# Altium schematic sheet 06_LED&Config.SchDoc
size A3; Engineer: Mehmet Selcuk Yayan; Organization: Procenne
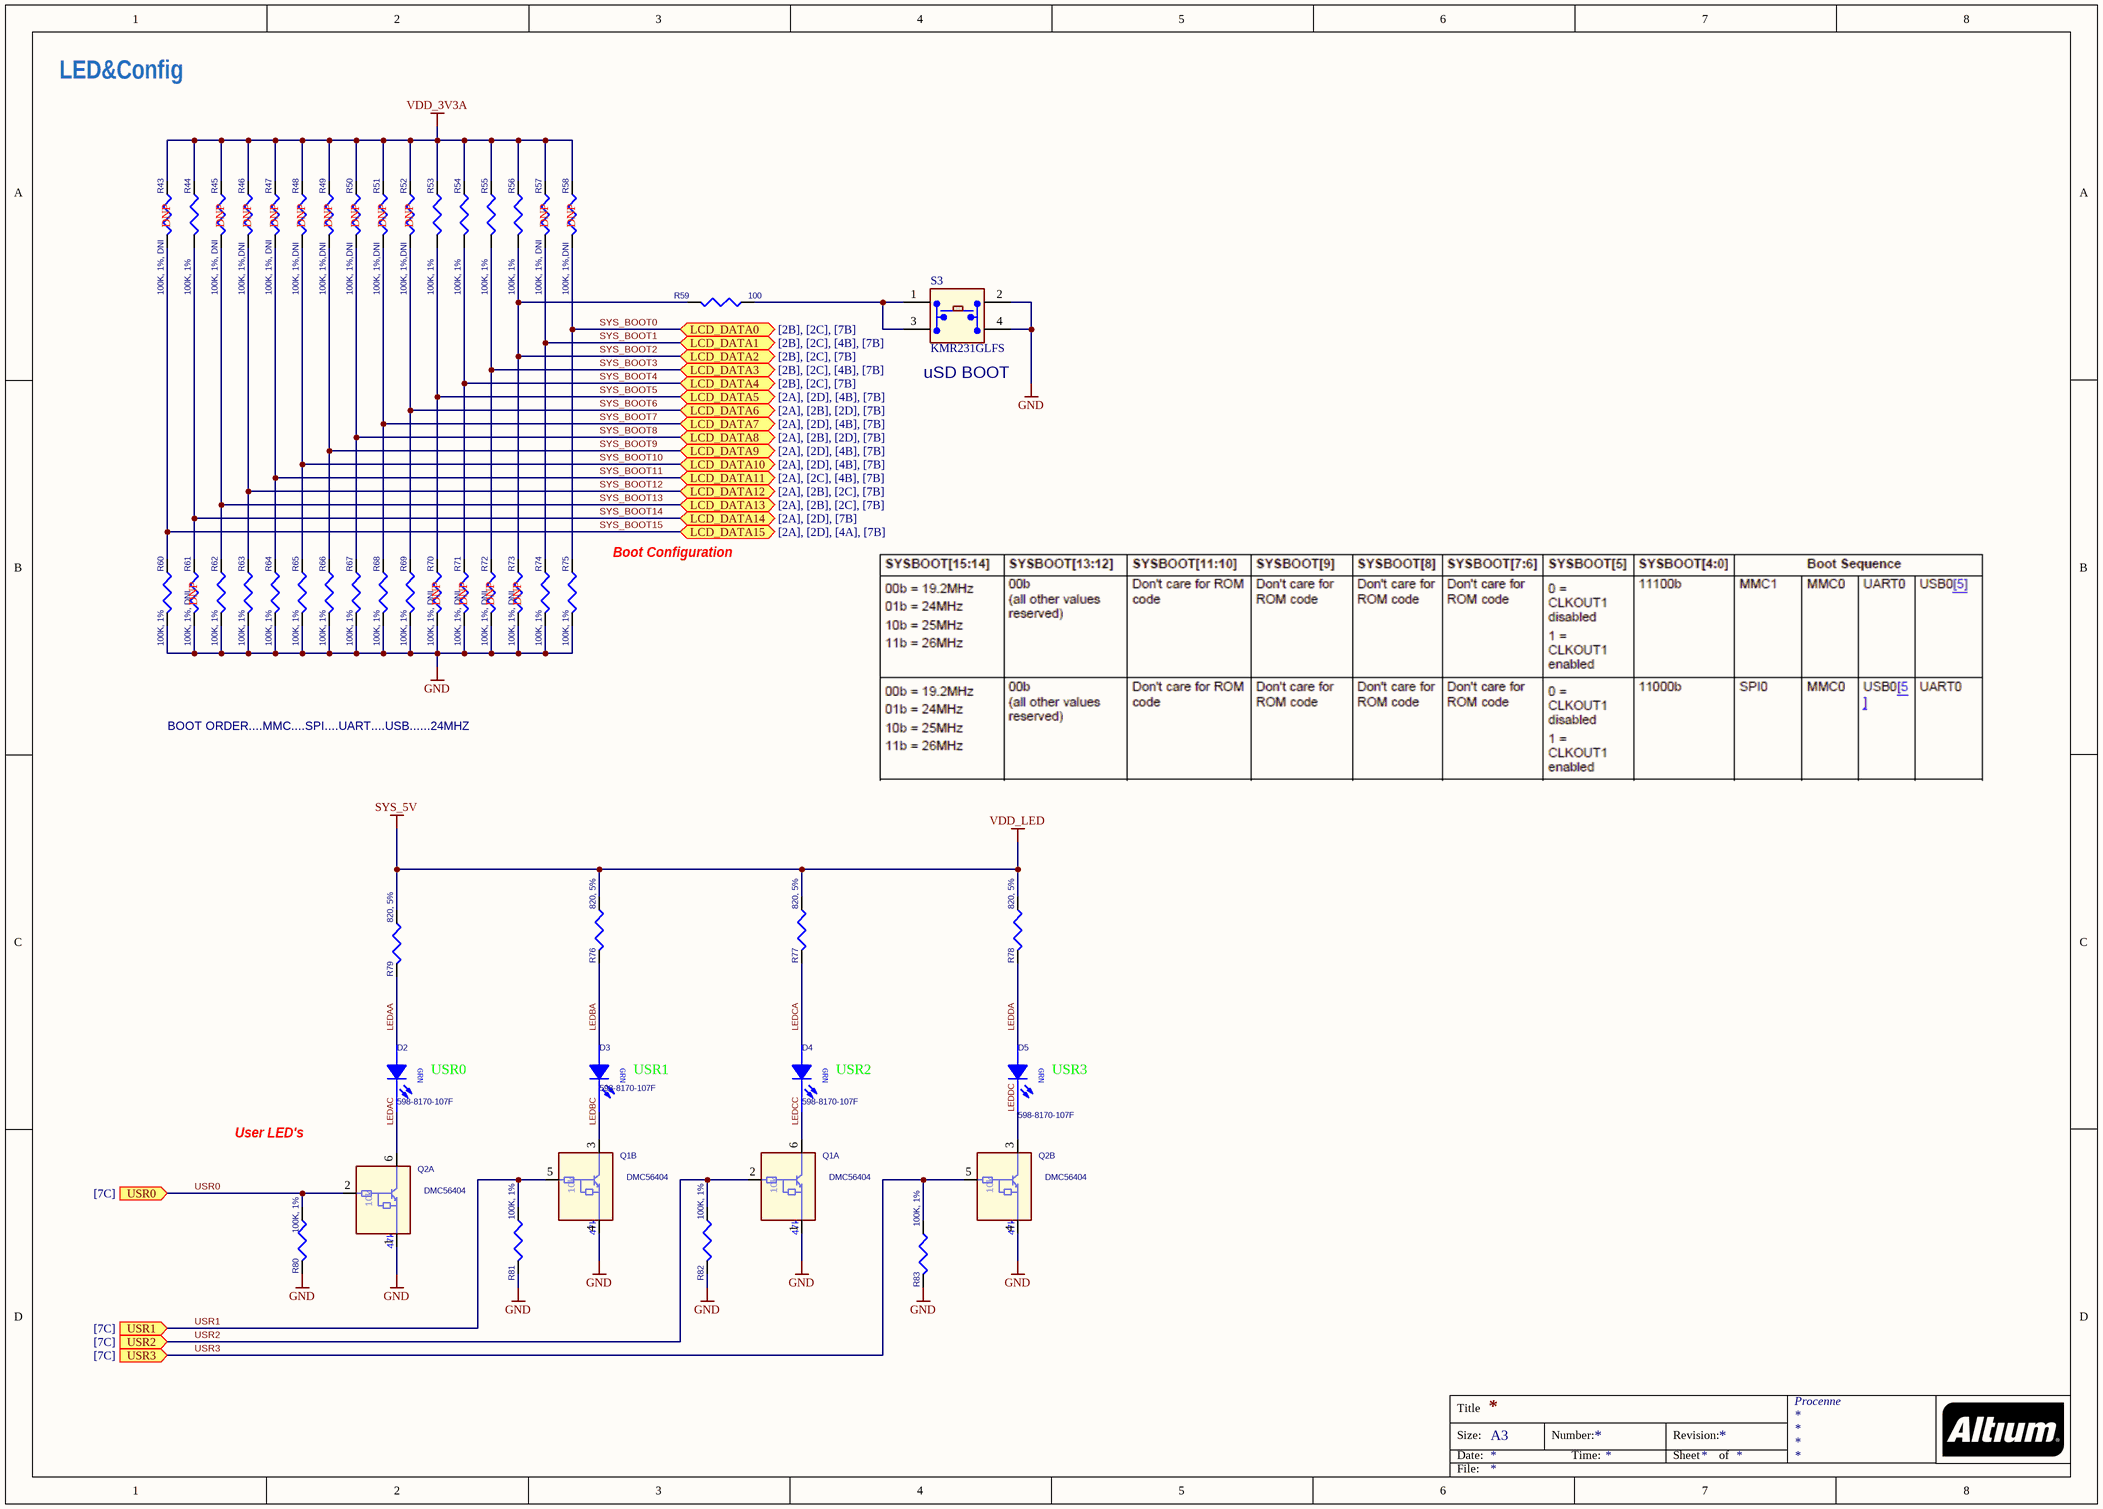
[diagram p0: 06_LED&Config.SchDoc]

## Parts
D2  598-8170-107F  [LED_0603]
D3  598-8170-107F  [LED_0603]
D4  598-8170-107F  [LED_0603]
D5  598-8170-107F  [LED_0603]
Q1  DMC56404  [SMini6-F3-B]  (parts A,B of 2)
Q2  DMC56404  [SMini6-F3-B]  (parts A,B of 2)
R43  100K, 1%, DNI  [402]
R44  100K, 1%  [402]
R45  100K, 1%, DNI  [402]
R46  100K, 1%,DNI  [402]
R47  100K, 1%, DNI  [402]
R48  100K, 1%,DNI  [402]
R49  100K, 1%,DNI  [402]
R50  100K, 1%,DNI  [402]
R51  100K, 1%,DNI  [402]
R52  100K, 1%,DNI  [402]
R53  100K, 1%  [402]
R54  100K, 1%  [402]
R55  100K, 1%  [402]
R56  100K, 1%  [402]
R57  100K, 1%, DNI  [402]
R58  100K, 1%,DNI  [402]
R59  100  [402]
R60  100K, 1%  [402]
R61  100K, 1%, DNI  [402]
R62  100K, 1%  [402]
R63  100K, 1%  [402]
R64  100K, 1%  [402]
R65  100K, 1%  [402]
R66  100K, 1%  [402]
R67  100K, 1%  [402]
R68  100K, 1%  [402]
R69  100K, 1%  [402]
R70  100K, 1%, DNI  [402]
R71  100K, 1%, DNI  [402]
R72  100K, 1%, DNI  [402]
R73  100K, 1%, DNI  [402]
R74  100K, 1%  [402]
R75  100K, 1%  [402]
R76  820, 5%  [402]
R77  820, 5%  [402]
R78  820, 5%  [402]
R79  820, 5%  [402]
R80  100K, 1%  [402]
R81  100K, 1%  [402]
R82  100K, 1%  [402]
R83  100K, 1%  [402]
S3  KMR231GLFS  [SW4SMD_63X161LS]

## Ports
LCD_DATA0 (bidir, see [2B], [2C], [7B]), LCD_DATA1 (bidir, see [2B], [2C], [4B], [7B]), LCD_DATA2 (bidir, see [2B], [2C], [7B]), LCD_DATA3 (bidir, see [2B], [2C], [4B], [7B]), LCD_DATA4 (bidir, see [2B], [2C], [7B]), LCD_DATA5 (bidir, see [2A], [2D], [4B], [7B]), LCD_DATA6 (bidir, see [2A], [2B], [2D], [7B]), LCD_DATA7 (bidir, see [2A], [2D], [4B], [7B]), LCD_DATA8 (bidir, see [2A], [2B], [2D], [7B]), LCD_DATA9 (bidir, see [2A], [2D], [4B], [7B]), LCD_DATA10 (bidir, see [2A], [2D], [4B], [7B]), LCD_DATA11 (bidir, see [2A], [2C], [4B], [7B]), LCD_DATA12 (bidir, see [2A], [2B], [2C], [7B]), LCD_DATA13 (bidir, see [2A], [2B], [2C], [7B]), LCD_DATA14 (bidir, see [2A], [2D], [7B]), LCD_DATA15 (bidir, see [2A], [2D], [4A], [7B]), USR0 (in, see [7C]), USR1 (in, see [7C]), USR2 (in, see [7C]), USR3 (in, see [7C])

## Nets
GND: Q1.1 Q1.4 Q2.1 Q2.4 R60.2 R61.2 R62.2 R63.2 R64.2 R65.2 R66.2 R67.2 R68.2 R69.2 R70.2 R71.2 R72.2 R73.2 R74.2 R75.2 R80.2 R81.2 R82.2 R83.2 S3.2(A2) S3.4
SYS_5V: R76.1 R77.1 R78.1 R79.1  [also labelled VDD_LED]
VDD_3V3A: R43.1 R44.1 R45.1 R46.1 R47.1 R48.1 R49.1 R50.1 R51.1 R52.1 R53.1 R54.1 R55.1 R56.1 R57.1 R58.1
LEDAA: D2.2(A) R79.2
LEDAC: D2.1(C) Q2.6
LEDBA: D3.2(A) R76.2
LEDBC: D3.1(C) Q1.3
LEDCA: D4.2(A) R77.2
LEDCC: D4.1(C) Q1.6
LEDDA: D5.2(A) R78.2
LEDDC: D5.1(C) Q2.3
SYS_BOOT0: R58.2 R75.1 ; port LCD_DATA0
SYS_BOOT1: R57.2 R74.1 ; port LCD_DATA1
SYS_BOOT2: R56.2 R59.1(P1) R73.1 ; port LCD_DATA2
SYS_BOOT3: R55.2 R72.1 ; port LCD_DATA3
SYS_BOOT4: R54.2 R71.1 ; port LCD_DATA4
SYS_BOOT5: R53.2 R70.1 ; port LCD_DATA5
SYS_BOOT6: R52.2 R69.1 ; port LCD_DATA6
SYS_BOOT7: R51.2 R68.1 ; port LCD_DATA7
SYS_BOOT8: R50.2 R67.1 ; port LCD_DATA8
SYS_BOOT9: R49.2 R66.1 ; port LCD_DATA9
SYS_BOOT10: R48.2 R65.1 ; port LCD_DATA10
SYS_BOOT11: R47.2 R64.1 ; port LCD_DATA11
SYS_BOOT12: R46.2 R63.1 ; port LCD_DATA12
SYS_BOOT13: R45.2 R62.1 ; port LCD_DATA13
SYS_BOOT14: R44.2 R61.1 ; port LCD_DATA14
SYS_BOOT15: R43.2 R60.1 ; port LCD_DATA15
USR0: Q2.2 R80.1 ; port USR0
USR1: Q1.5 R81.1 ; port USR1
USR2: Q1.2 R82.1 ; port USR2
USR3: Q2.5 R83.1 ; port USR3
NetR59_2: R59.2(P2) S3.1(A1) S3.3(A3)

## Notes on the sheet
- LED&Config
- (near R43) DNP
- (near R45) DNP
- (near R46) DNP
- (near R47) DNP
- (near R48) DNP
- (near R49) DNP
- (near R50) DNP
- (near R51) DNP
- (near R52) DNP
- (near R57) DNP
- (near R58) DNP
- (near S3) uSD BOOT
- (near R75) Boot Configuration
- (near R61) DNP
- (near R70) DNP
- (near R71) DNP
- (near R72) DNP
- (near R73) DNP
- BOOT ORDER....MMC....SPI....UART....USB......24MHZ
- (near D2) USR0
- (near D3) USR1
- (near D4) USR2
- (near D5) USR3
- User LED's
- Title
- Size:
- Date:
- A3
- Number:
- Time:
- Revision:
- Sheet
- of
- File:
- (in symbol LED_LTST-C150GKT) GRN

## Library data of the parts
D2-D5 = LED_LTST-C150GKT: LED GREEN CLEAR 0805 SMD; Manufacturer: Lite-On Inc; Manufacturer Part Number: LTST-C170KGKT; CLASS: DISCRETE; TN: 257-0020-000; Current - Test: 20mA; Lens Style/Size: Rectangle with Flat Top, 1.4mm x 1.25mm; Millicandela Rating: 35mcd; Viewing Angle: 130°; Voltage - Forward (Vf) Typ: 2V; Wavelength - Dominant: 571nm; Wavelength - Peak: 574nm; Category: Optoelectronics; Color: Green; ComponentLink1Description: http://optoelectronics.liteon.com/en-us/api/DwonloadFileHandler.ashx?txtSpecNo=DS22-2000-073&txtPartNo=LTST-C170KGKT; ComponentLink1URL: http://optoelectronics.liteon.com/en-us/api/DwonloadFileHandler.ashx?txtSpecNo=DS22-2000-073&txtPartNo=LTST-C170KGKT; Height: 1.10mm; Lens Type: Clear; Luminous Flux @ Current - Test: -; Mounting Type: Surface Mount; Package / Case: 0805 (2012 Metric); Packaging: Digi-Reel®; Pricing 1: 1=0.37, 10=0.267, 100=0.1574, 250=0.11136, 500=0.09504, 1000=0.07425 (USD); RoHS: RoHS Compliant; Size / Dimension: 2.00mm L x 1.25mm W; Stock 1: 274890; Supplier 1: Digi-Key; Supplier Part Number 1: 160-1414-6-ND
Q1 Q2 = RN1907: TRANS PREBIASED DUAL NPN SOT363; Manufacturer: Toshiba; Manufacturer Part Number: DDC114YU-7-F; Order# 2: BCR135S; ATLStockNo1: 2130.0137; ATLStockNo2: 2130.01; Transistor Type: 2 NPN - Pre-Biased (Dual); Current - Collector (Ic) (Max): 100mA; Voltage - Collector Emitter Breakdown (Max): 50V; Resistor - Base (R1) (Ohms): 10k; Resistor - Emitter Base (R2) (Ohms): 47k; DC Current Gain (hFE) (Min) @ Ic, Vce: 68 @ 10mA, 5V; Vce Saturation (Max) @ Ib, Ic: 300mV @ 250µA, 5mA; Current - Collector Cutoff (Max): 500nA; Frequency - Transition: 250MHz; Power - Max: 200mW; Supplier 1: Digi-Key; Supplier Part Number 1: DDC114YU-FDIDKR-ND; RoHS: RoHS Compliant; Category: Discrete Semiconductor Products; Stock 1: 11411; Pricing 1: 1=0.46, 10=0.334, 25=0.2596, 100=0.1966, 250=0.13896, 500=0.11124, 1000=0.08532 (USD); Mounting Type: Surface Mount; Package / Case: 6-TSSOP, SC-88, SOT-363; Supplier Device Package: SOT-363; Packaging: Digi-Reel®; ComponentLink1URL: http://www.diodes.com/datasheets/ds30345.pdf; ComponentLink1Description: http://www.diodes.com/datasheets/ds30345.pdf
R43-R58 R60-R75 R80-R83 = RES_100K_1/16W_1%_0402: RES 100K OHM 1/16W 1% 0402 SMD; Manufacturer: Stackpole Electronics Inc; Manufacturer Part Number: RMCF0402FT100K; Power (Watts): 0.063W, 1/16W; Temperature Coefficient: ±100ppm/°C; Category: Resistors; ComponentLink1Description: http://www.seielect.com/Catalog/SEI-RMCF_RMCP.pdf; ComponentLink1URL: http://www.seielect.com/Catalog/SEI-RMCF_RMCP.pdf; Composition: Thick Film; Features: -; Height: 0.016" (0.40mm); Number of Terminations: 2; Package / Case: 0402 (1005 Metric); Packaging: Digi-Reel®; Pricing 1: 1=0.04, 10=0.025, 50=0.0138, 100=0.0105, 250=0.0078, 500=0.00576, 1000=0.00384, 2500=0.00324, 5000=0.0027 (USD); Resistance (Ohms): 100k; RoHS: RoHS Compliant; Size / Dimension: 0.039" L x 0.020" W (1.00mm x 0.50mm); Stock 1: 851196; Supplier 1: Digi-Key; Supplier Device Package: 0402; Supplier Part Number 1: RMCF0402FT100KDKR-ND; Tolerance: ±1%
R59 = RES SMD: RES 100 OHM 1/10W 5% 0402 SMD; Manufacturer: Panasonic Electronic Components; Manufacturer Part Number: ERJ-2RKF1000X; Power (Watts): 0.1W, 1/10W; Temperature Coefficient: ±100ppm/°C; Category: Resistors; ComponentLink1Description: http://industrial.panasonic.com/www-cgi/jvcr13pz.cgi?E+PZ+3+AOA0002+ERJ2RKF1000X+7+WW; ComponentLink1URL: http://industrial.panasonic.com/www-cgi/jvcr13pz.cgi?E+PZ+3+AOA0002+ERJ2RKF1000X+7+WW; Composition: Thick Film; Features: -; Height: 0.016" (0.40mm); Number of Terminations: 2; Package / Case: 0402 (1005 Metric); Packaging: Digi-Reel®; Pricing 1: 1=0.1, 50=0.0242, 100=0.0184, 250=0.01364, 500=0.01008, 1000=0.00672, 5000=0.00473 (USD); Resistance (Ohms): 100; RoHS: RoHS; Size / Dimension: 0.039" L x 0.020" W (1.00mm x 0.50mm); Stock 1: 2375521; Supplier 1: Digi-Key; Supplier Device Package: 0402; Supplier Part Number 1: P100LDKR-ND
R76-R79 = RES_470_1/10W_5%_0402: RES 820 OHM 1/10W 5% 0402 SMD; Manufacturer: Yageo; Manufacturer Part Number: RC0402JR-07820RL; Power (Watts): 0.063W, 1/16W; Resistance (Ohms): 820; Temperature Coefficient: ±100ppm/°C; Category: Resistors; ComponentLink1Description: http://www.yageo.com/documents/recent/PYu-RC0402_51_RoHS_L_6.pdf; ComponentLink1URL: http://www.yageo.com/documents/recent/PYu-RC0402_51_RoHS_L_6.pdf; Composition: Thick Film; Features: -; Height: 0.016" (0.40mm); Number of Terminations: 2; Package / Case: 0402 (1005 Metric); Packaging: Digi-Reel®; Pricing 1: 1=0.1, 10=0.012, 25=0.0092, 100=0.0055, 250=0.00476, 500=0.00336, 1000=0.00237, 2500=0.00206, 5000=0.00178 (USD); RoHS: RoHS Compliant; Size / Dimension: 0.039" L x 0.020" W (1.00mm x 0.50mm); Stock 1: 7437; Supplier 1: Digi-Key; Supplier Device Package: 0402; Supplier Part Number 1: 311-820JRDKR-ND; Tolerance: ±5%
S3 = KMR2: Microminiature Tact Switch for SMT; Manufacturer: C&K Components; Circuit: SPST-NO; Switch Function: Off-Mom; Contact Rating @ Voltage: 0.05A @ 32VDC; Actuator Type: Standard; Actuator Height off PCB, from Pins: 1.90mm; Actuator Orientation: Top Actuated; Outline: 4.60mm x 2.80mm; Illumination: Non-Illuminated; Operating Force: 300gf; Switch Travel: 0.25mm; Mechanical Life: 150,000 Cycles; Supplier 1: Digi-Key; Supplier Part Number 1: 401-1429-6-ND; Manufacturer Part Number: KMR231GLFS; RoHS: RoHS Compliant; Category: Switches; Stock 1: 32289; Pricing 1: 1=0.44, 10=0.416, 25=0.3744, 50=0.3326, 100=0.3188, 250=0.29108, 500=0.2772, 1000=0.22869 (USD); Mounting Type: Surface Mount; Termination Style: Gull Wing; Illumination Voltage (Nominal): -; Illumination Type, Color: -; Ingress Protection: -; Features: Grounding Pin; Packaging: Digi-Reel®; Actuator Material: -; Operating Temperature: -40°C ~ 85°C; ComponentLink1URL: http://www.ck-components.com/index.php?module=media&action=Display&cmpref=14414&lang=en&width=&height=&format=&alt=; ComponentLink1Description: http://www.ck-components.com/index.php?module=media&action=Display&cmpref=14414&lang=en&width=&height=&format=&alt=